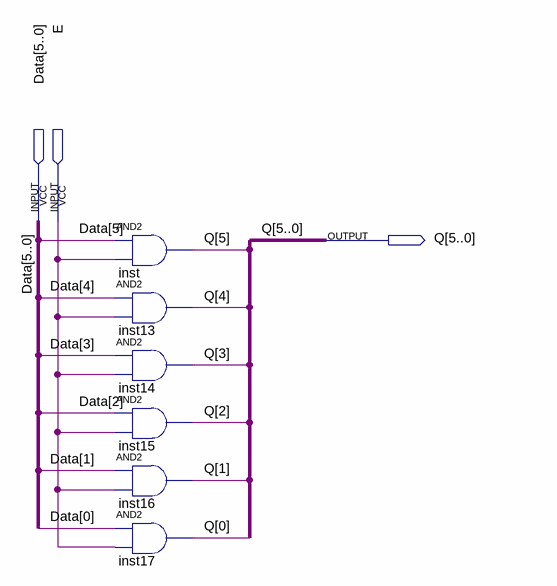
[diagram p0: schematic sheet]
// Quartus schematic BusEnable.bdf as structural Verilog: 6 symbols, 3 pins
module BusEnable (
  input  [5:0] Data,
  input  E,
  output [5:0] Q
);

  and inst (Q[5], Data[5], E);
  and inst13 (Q[4], Data[4], E);
  and inst14 (Q[3], Data[3], E);
  and inst15 (Q[2], Data[2], E);
  and inst16 (Q[1], Data[1], E);
  and inst17 (Q[0], Data[0], E);
endmodule
